# Altium project SDC_V2.1.PrjPcb (part 2 of 4)

## Sheet CTRL_IF.SchDoc
size 420 x 297 mm; SheetNumber: 7; PageSetup: Record=PageOptions|CenterHorizontal=False|CenterVertical=False|PrintScale=0.95|XCorrection=0.00|YCorrection=0.00|PrintKind=1|BorderSize=5000000|LeftOffset=0|BottomOffset=0|Orientation=1|PaperLength=1000|PaperWidth=1000|Scale=100|PaperSource=15|PrintQuality=600|MediaType=1|DitherType=10|PaperKind=A4|PrintScaleMode=1
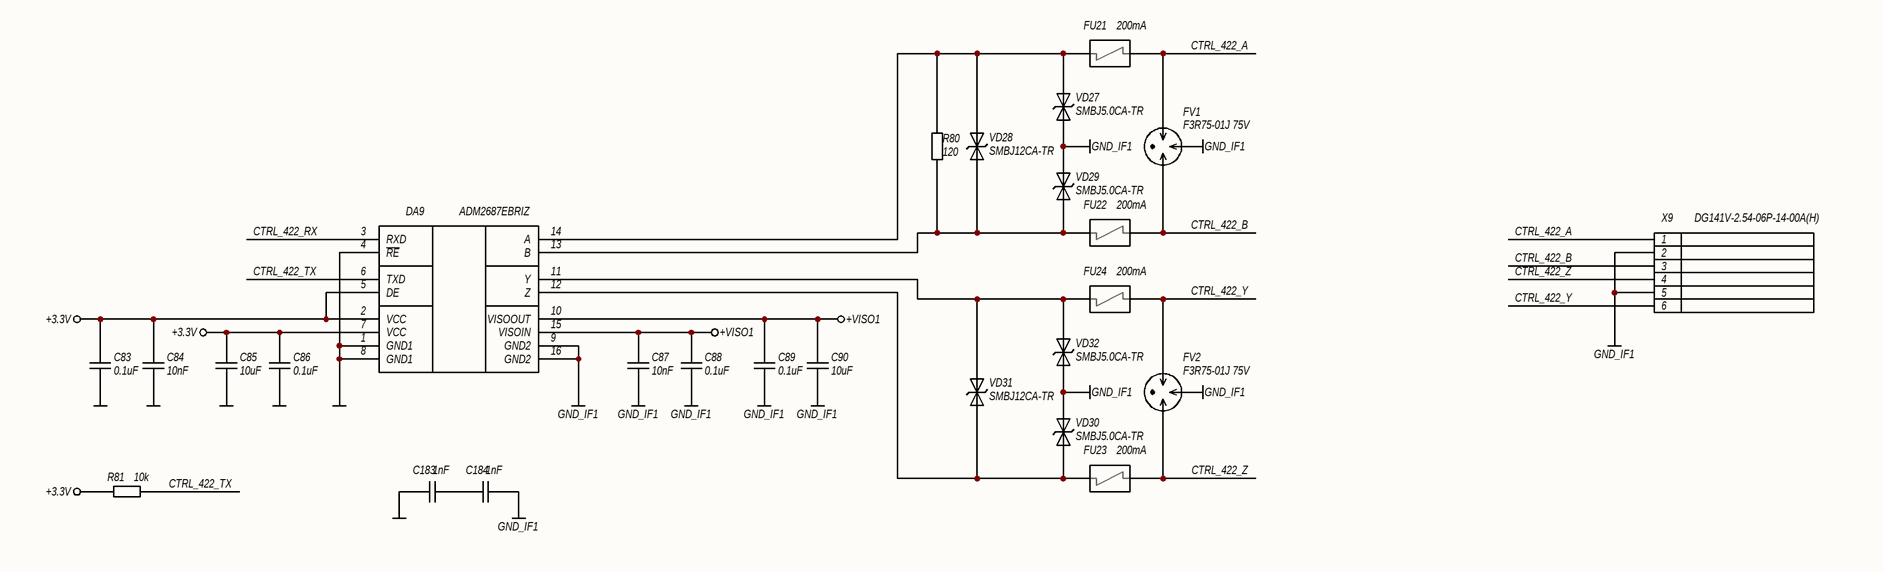
[diagram p5: CTRL_IF.SchDoc]

### Parts
C83  0.1uF  [C0603N]
C84  10nF  [C0603N]
C85  10uF  [C0805N]
C86  0.1uF  [C0603N]
C87  10nF  [C0603N]
C88  0.1uF  [C0603N]
C89  0.1uF  [C0603N]
C90  10uF  [C0805N]
C183  1nF  [C1808N]
C184  1nF  [C1808N]
DA9  ADM2687EBRIZ  [SOIC16_IC]
FU21  200mA  [TBU-CA]
FU22  200mA  [TBU-CA]
FU23  200mA  [TBU-CA]
FU24  200mA  [TBU-CA]
FV1  F3R75-01J 75V  [GDT_3PIN_B2]
FV2  F3R75-01J 75V  [GDT_3PIN_B2]
R80  120  [R0805N]
R81  10k  [R0603N]
VD27  SMBJ5.0CA-TR  [SMB]
VD28  SMBJ12CA-TR  [SMB]
VD29  SMBJ5.0CA-TR  [SMB]
VD30  SMBJ5.0CA-TR  [SMB]
VD31  SMBJ12CA-TR  [SMB]
VD32  SMBJ5.0CA-TR  [SMB]
X9  DG141V-2.54-06P-14-00A(H)  [DG141V-2.54-06P-14-00A(H)]

### Nets
+3.3V: C83.2 C84.1 C85.2 C86.2 DA9.2(VCC) DA9.5(DE) DA9.7(VCC) R81.2
+VISO1: C87.1 C88.2 C89.2 C90.2 DA9.10(VISOOUT) DA9.15(VISOIN)
GND: C83.1 C84.2 C85.1 C86.1 C183.2 DA9.1(GND1) DA9.4(~{RE}) DA9.8(GND1)
GND_IF1: C87.2 C88.1 C89.1 C90.1 C184.1 DA9.9(GND2) DA9.16(GND2) FV1.2 FV2.2 VD27.2(A2) VD29.2(A2) VD30.2(A2) VD32.2(A2) X9.2 X9.5
CTRL_422_A: FU21.3(IN/OUT) FV1.1 X9.1
CTRL_422_B: FU22.3(IN/OUT) FV1.3 X9.3
CTRL_422_RX: DA9.3(RXD)
CTRL_422_TX: DA9.6(TXD) R81.1
CTRL_422_Y: FU24.3(IN/OUT) FV2.3 X9.6
CTRL_422_Z: FU23.3(IN/OUT) FV2.1 X9.4
NetC183_1: C183.1 C184.2
NetDA9_11: DA9.11(Y) FU24.1(IN/OUT) VD31.2(A2) VD32.1(A1)
NetDA9_12: DA9.12(Z) FU23.1(IN/OUT) VD30.1(A1) VD31.1(A1)
NetDA9_13: DA9.13(B) FU22.1(IN/OUT) R80.2 VD28.2(A2) VD29.1(A1)
NetDA9_14: DA9.14(A) FU21.1(IN/OUT) R80.1 VD27.1(A1) VD28.1(A1)

### Notes on the sheet
- Подп. и дата
- Инв. № дубл.
- Взам. инв. №
- Инв. № подл.
- Лист
- Изм.
- № докум.
- Подп.
- Дата
- Копировал
- Формат А3

### Library data of the parts
C83 C86 C88 C89 = CL10B104KB8NNNC: as C3 on sheet MCU; Артикул: CL10B104KB8NNNC; Номинал: 0.1uF; Строка для документации: https://mm.digikey.com/Volume0/opasdata/d220001/medias/docus/609/CL10B104KB8NNNC_Spec.pdf; Тип элемента: Конденсатор
C84 C87 = CL10B103KB8NNNC: as C29 on sheet DRIVER_A; Артикул: CL10B103KB8NNNC; Номинал: 10nF; Строка для документации: https://mm.digikey.com/Volume0/opasdata/d220001/medias/docus/609/CL10B103KB8NNNC_Spec.pdf; Тип элемента: Конденсатор
C85 C90 = CL21A106KAYNNNE: Конденсатор; Точность: 10%; Напряжение: 25V; Диэлектрик: X5R; Производитель: Samsung Electro-Mechanics; Описание: 10 µF ±10% 25V Ceramic Capacitor X5R 0805 (2012 Metric); Корпус: 0805 (2012 Metric); Температурный диапазон: -55°C ~ 85°C; Вид монтажа: SMD; Артикул: CL21A106KAYNNNE; Номинал: 10uF; Строка для документации: https://mm.digikey.com/Volume0/opasdata/d220001/medias/docus/5545/CL21A106KAYNNNE%20Spec.pdf; Тип элемента: Конденсатор
C183 C184 = GA342DR7GF102KW02L: Конденсатор; Точность: 10%; Напряжение: 250VAC; Диэлектрик: X7R; Производитель: Murata Electronics; Описание: 1000 pF ±10% 250VAC Ceramic Capacitor X7R 1808 (4520 Metric); Корпус: 1808 (4520 Metric); Температурный диапазон: -55°C ~ 125°C; Вид монтажа: SMD; Артикул: GA342DR7GF102KW02L; Номинал: 1nF; Строка для документации: https://search.murata.co.jp/Ceramy/image/img/A01X/G101/ENG/GA342DR7GF102KW02-01.pdf; Тип элемента: Конденсатор
DA9 = ADM2687EBRIZ: Микросхема интерфейса RS485; Производитель: Analog Devices Inc.; Описание: RS422, RS485 Digital Isolator 5000Vrms 3 Channel 500kbps 25kV/µs CMTI 16-SOIC (0.295", 7.50mm Width); Корпус: 16-SOIC (0.295", 7.50mm Width); Температурный диапазон: -40°C ~ 85°C; Вид монтажа: SMD; Артикул: ADM2687EBRIZ; Строка для документации: https://www.analog.com/media/en/technical-documentation/data-sheets/ADM2682E_2687E.pdf; Тип элемента: Микросхема
FU21-FU24 = TBU-CA065-200-WH: Полупроводниковый предохранитель; Напряжение: 650V; Тип: Surge Suppression IС; Производитель: Bourns Inc.; Описание: SURGE SUPP TBU 200MA 650VIMP SMD; Корпус: 6.50mm x 4.00mm; Температурный диапазон: -55°C ~ 125°C; Вид монтажа: SMD; Артикул: TBU-CA065-200-WH; Ток: 200mA; Строка для документации: https://www.bourns.com/docs/Product-Datasheets/TBU-CA.pdf; Тип элемента: Предохранитель
FV1 FV2 = F3R75-01J 75V: Газовый разрядник, трехвыводный; Ток: 10kA; Тип: Gas Discharge Tube Arresters (GDT); Производитель: ZF; Описание: Gas Discharge Tube 75 V 10000A (10kA) ±25% 3 Pole Through Hole Mount; Корпус: 11.5mm x 7.5mm dia.; Вид монтажа: Through hole; Артикул: F3R75-01J 75V; Напряжение пробоя: 75V; Строка для документации: http://nbruitian.com/show.asp?id=1412; Тип элемента: Газовый разрядник
R80 = RC0805FR-07120RL: Резистор; Точность: 1%; ТКС: ±100ppm/°C; Напряжение: 150V; Производитель: YAGEO; Описание: 120 Ohms ±1% 0.125W, 1/8W Chip Resistor 0805 (2012 Metric) Moisture Resistant Thick Film; Корпус: 0805 (2012 Metric); Температурный диапазон: -55°C ~ 155°C; Вид монтажа: SMD; Артикул: RC0805FR-07120RL; Номинал: 120; Строка для документации: https://www.yageo.com/upload/media/product/productsearch/datasheet/rchip/PYu-RC_Group_51_RoHS_L_12.pdf; Тип элемента: Резистор
R81 = RC0603FR-0710KL: as R4 on sheet MCU; Артикул: RC0603FR-0710KL; Номинал: 10k; Строка для документации: https://www.yageo.com/upload/media/product/app/datasheet/rchip/pyu-rc_group_51_rohs_l.pdf; Тип элемента: Резистор
VD27 VD29 VD30 VD32 = SMBJ5.0CA-TR: TVS диод двунаправленный; Напряжение: 5V; Напряжение ограничения: 9.2V; Напряжение пробоя: 6.4V; Ток: 68A; Тип: TVS Bidirectional; Производитель: STMicroelectronics; Описание: 9.2V Clamp 68A Ipp Tvs Diode Surface Mount SMB (DO-214AA); Корпус: DO-214AA, SMB; Температурный диапазон: -55°C ~ 150°C (TJ); Вид монтажа: SMD; Тип элемента: Диод защитный; Артикул: SMBJ5.0CA-TR; Строка для документации: https://www.st.com/content/ccc/resource/technical/document/datasheet/19/78/91/39/07/cd/40/65/CD00001366.pdf/files/CD00001366.pdf/_jcr_content/translations/en.CD00001366.pdf
VD28 VD31 = SMBJ12CA-TR: TVS диод двунаправленный; Напряжение: 12V; Напряжение ограничения: 19.9V; Напряжение пробоя: 13.3V; Ток: 31A; Тип: TVS Bidirectional; Производитель: STMicroelectronics; Описание: 19.9V Clamp 31A Ipp Tvs Diode Surface Mount SMB (DO-214AA); Корпус: DO-214AA, SMB; Температурный диапазон: -55°C ~ 150°C (TJ); Вид монтажа: SMD; Тип элемента: Диод защитный; Артикул: SMBJ12CA-TR; Строка для документации: https://www.st.com/content/ccc/resource/technical/document/datasheet/19/78/91/39/07/cd/40/65/CD00001366.pdf/files/CD00001366.pdf/_jcr_content/translations/en.CD00001366.pdf
X9 = DG141V-2.54-06P-14-00A(H): as X7 on sheet INC_ENC_IF; Артикул: DG141V-2.54-06P-14-00A(H); Строка для документации: https://static.chipdip.ru/lib/874/DOC000874680.pdf; Тип элемента: Разъем

## Sheet TELEM_IF.SchDoc
size 420 x 297 mm; SheetNumber: 6; PageSetup: Record=PageOptions|CenterHorizontal=False|CenterVertical=False|PrintScale=0.95|XCorrection=0.00|YCorrection=0.00|PrintKind=1|BorderSize=5000000|LeftOffset=0|BottomOffset=0|Orientation=1|PaperLength=1000|PaperWidth=1000|Scale=100|PaperSource=15|PrintQuality=600|MediaType=1|DitherType=10|PaperKind=A4|PrintScaleMode=1
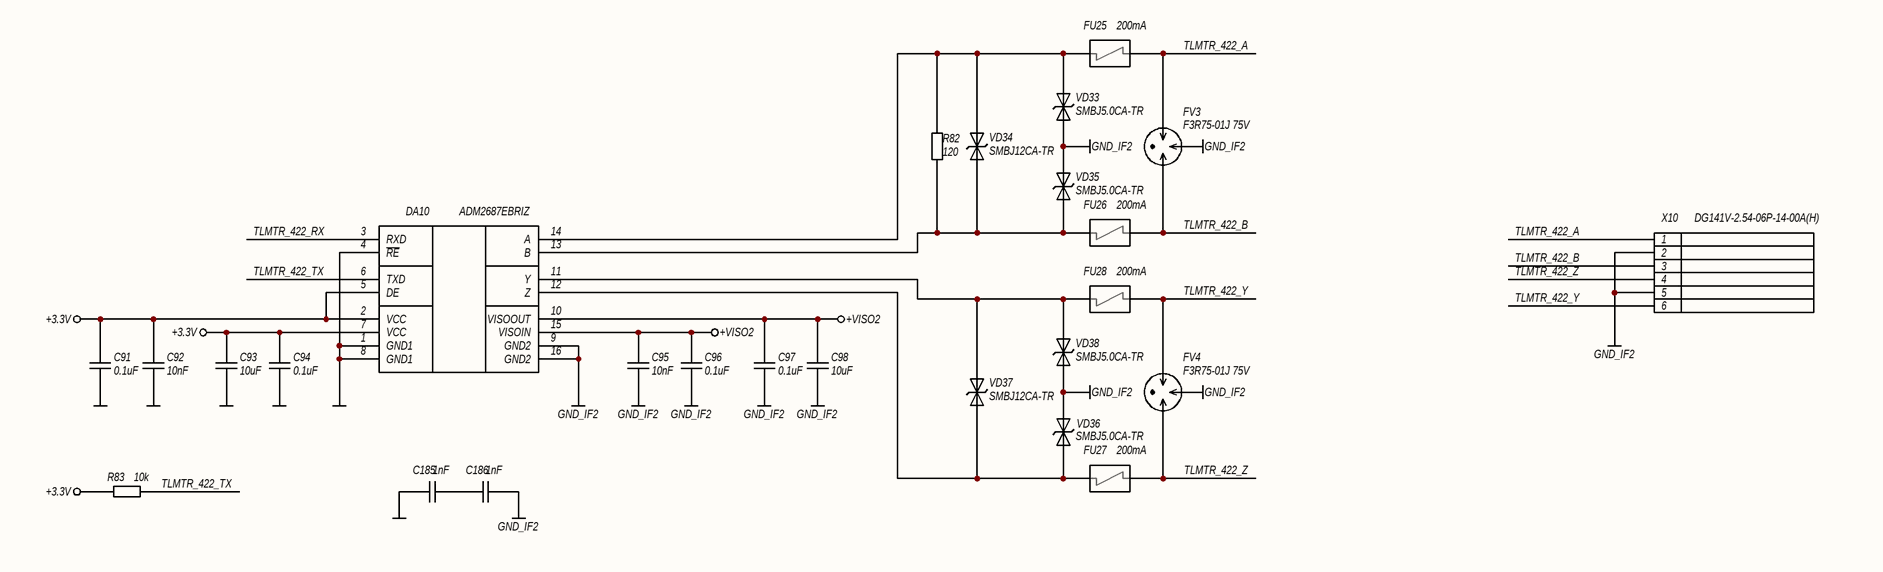
[diagram p6: TELEM_IF.SchDoc]

### Parts
C91  0.1uF  [C0603N]
C92  10nF  [C0603N]
C93  10uF  [C0805N]
C94  0.1uF  [C0603N]
C95  10nF  [C0603N]
C96  0.1uF  [C0603N]
C97  0.1uF  [C0603N]
C98  10uF  [C0805N]
C185  1nF  [C1808N]
C186  1nF  [C1808N]
DA10  ADM2687EBRIZ  [SOIC16_IC]
FU25  200mA  [TBU-CA]
FU26  200mA  [TBU-CA]
FU27  200mA  [TBU-CA]
FU28  200mA  [TBU-CA]
FV3  F3R75-01J 75V  [GDT_3PIN_B2]
FV4  F3R75-01J 75V  [GDT_3PIN_B2]
R82  120  [R0805N]
R83  10k  [R0603N]
VD33  SMBJ5.0CA-TR  [SMB]
VD34  SMBJ12CA-TR  [SMB]
VD35  SMBJ5.0CA-TR  [SMB]
VD36  SMBJ5.0CA-TR  [SMB]
VD37  SMBJ12CA-TR  [SMB]
VD38  SMBJ5.0CA-TR  [SMB]
X10  DG141V-2.54-06P-14-00A(H)  [DG141V-2.54-06P-14-00A(H)]

### Nets
+3.3V: C91.2 C92.1 C93.2 C94.2 DA10.2(VCC) DA10.5(DE) DA10.7(VCC) R83.2
+VISO2: C95.1 C96.2 C97.2 C98.2 DA10.10(VISOOUT) DA10.15(VISOIN)
GND: C91.1 C92.2 C93.1 C94.1 C185.2 DA10.1(GND1) DA10.4(~{RE}) DA10.8(GND1)
GND_IF2: C95.2 C96.1 C97.1 C98.1 C186.1 DA10.9(GND2) DA10.16(GND2) FV3.2 FV4.2 VD33.2(A2) VD35.2(A2) VD36.2(A2) VD38.2(A2) X10.2 X10.5
TLMTR_422_A: FU25.3(IN/OUT) FV3.1 X10.1
TLMTR_422_B: FU26.3(IN/OUT) FV3.3 X10.3
TLMTR_422_RX: DA10.3(RXD)
TLMTR_422_TX: DA10.6(TXD) R83.1
TLMTR_422_Y: FU28.3(IN/OUT) FV4.3 X10.6
TLMTR_422_Z: FU27.3(IN/OUT) FV4.1 X10.4
NetC185_1: C185.1 C186.2
NetDA10_11: DA10.11(Y) FU28.1(IN/OUT) VD37.2(A2) VD38.1(A1)
NetDA10_12: DA10.12(Z) FU27.1(IN/OUT) VD36.1(A1) VD37.1(A1)
NetDA10_13: DA10.13(B) FU26.1(IN/OUT) R82.2 VD34.2(A2) VD35.1(A1)
NetDA10_14: DA10.14(A) FU25.1(IN/OUT) R82.1 VD33.1(A1) VD34.1(A1)

### Notes on the sheet
- Подп. и дата
- Инв. № дубл.
- Взам. инв. №
- Инв. № подл.
- Лист
- Изм.
- № докум.
- Подп.
- Дата
- Копировал
- Формат А3

### Library data of the parts
C91 C94 C96 C97 = CL10B104KB8NNNC: as C3 on sheet MCU; Артикул: CL10B104KB8NNNC; Номинал: 0.1uF; Строка для документации: https://mm.digikey.com/Volume0/opasdata/d220001/medias/docus/609/CL10B104KB8NNNC_Spec.pdf; Тип элемента: Конденсатор
C92 C95 = CL10B103KB8NNNC: as C29 on sheet DRIVER_A; Артикул: CL10B103KB8NNNC; Номинал: 10nF; Строка для документации: https://mm.digikey.com/Volume0/opasdata/d220001/medias/docus/609/CL10B103KB8NNNC_Spec.pdf; Тип элемента: Конденсатор
C93 C98 = CL21A106KAYNNNE: as C85 on sheet CTRL_IF; Артикул: CL21A106KAYNNNE; Номинал: 10uF; Строка для документации: https://mm.digikey.com/Volume0/opasdata/d220001/medias/docus/5545/CL21A106KAYNNNE%20Spec.pdf; Тип элемента: Конденсатор
C185 C186 = GA342DR7GF102KW02L: as C183 on sheet CTRL_IF; Артикул: GA342DR7GF102KW02L; Номинал: 1nF; Строка для документации: https://search.murata.co.jp/Ceramy/image/img/A01X/G101/ENG/GA342DR7GF102KW02-01.pdf; Тип элемента: Конденсатор
DA10 = ADM2687EBRIZ: as DA9 on sheet CTRL_IF; Артикул: ADM2687EBRIZ; Строка для документации: https://www.analog.com/media/en/technical-documentation/data-sheets/ADM2682E_2687E.pdf; Тип элемента: Микросхема
FU25-FU28 = TBU-CA065-200-WH: as FU21 on sheet CTRL_IF; Артикул: TBU-CA065-200-WH; Ток: 200mA; Строка для документации: https://www.bourns.com/docs/Product-Datasheets/TBU-CA.pdf; Тип элемента: Предохранитель
FV3 FV4 = F3R75-01J 75V: as FV1 on sheet CTRL_IF; Артикул: F3R75-01J 75V; Напряжение пробоя: 75V; Строка для документации: http://nbruitian.com/show.asp?id=1412; Тип элемента: Газовый разрядник
R82 = RC0805FR-07120RL: as R80 on sheet CTRL_IF; Артикул: RC0805FR-07120RL; Номинал: 120; Строка для документации: https://www.yageo.com/upload/media/product/productsearch/datasheet/rchip/PYu-RC_Group_51_RoHS_L_12.pdf; Тип элемента: Резистор
R83 = RC0603FR-0710KL: as R4 on sheet MCU; Артикул: RC0603FR-0710KL; Номинал: 10k; Строка для документации: https://www.yageo.com/upload/media/product/app/datasheet/rchip/pyu-rc_group_51_rohs_l.pdf; Тип элемента: Резистор
VD33 VD35 VD36 VD38 = SMBJ5.0CA-TR: as VD27 on sheet CTRL_IF; Артикул: SMBJ5.0CA-TR; Строка для документации: https://www.st.com/content/ccc/resource/technical/document/datasheet/19/78/91/39/07/cd/40/65/CD00001366.pdf/files/CD00001366.pdf/_jcr_content/translations/en.CD00001366.pdf
VD34 VD37 = SMBJ12CA-TR: as VD28 on sheet CTRL_IF; Артикул: SMBJ12CA-TR; Строка для документации: https://www.st.com/content/ccc/resource/technical/document/datasheet/19/78/91/39/07/cd/40/65/CD00001366.pdf/files/CD00001366.pdf/_jcr_content/translations/en.CD00001366.pdf
X10 = DG141V-2.54-06P-14-00A(H): as X7 on sheet INC_ENC_IF; Артикул: DG141V-2.54-06P-14-00A(H); Строка для документации: https://static.chipdip.ru/lib/874/DOC000874680.pdf; Тип элемента: Разъем

## Sheet RS485_IF.SchDoc: {Наименование}
size 420 x 297 mm; ApprovedBy: {Утвердил}; CheckedBy: {Проверил}; DrawnBy: {Разраб.}; DocumentNumber: АБВГ 123456.789 00; SheetNumber: 7; SheetTotal: {}; Scale: {Мш.}; PageSetup: Record=PageOptions|CenterHorizontal=False|CenterVertical=False|PrintScale=0.95|XCorrection=0.00|YCorrection=0.00|PrintKind=1|BorderSize=5000000|LeftOffset=0|BottomOffset=0|Orientation=1|PaperLength=1000|PaperWidth=1000|Scale=100|PaperSource=15|PrintQuality=600|MediaType=1|DitherType=10|PaperKind=A4|PrintScaleMode=1; ProcessInspection: {Т.контр.}; Mass: {М.}; NormInspection: {Н.контр.}; Letter1Column: {}; Letter2Column: {}; Letter3Column: {}; DocumentType: {Документ}; Rule: PcbType=ProtelPcb
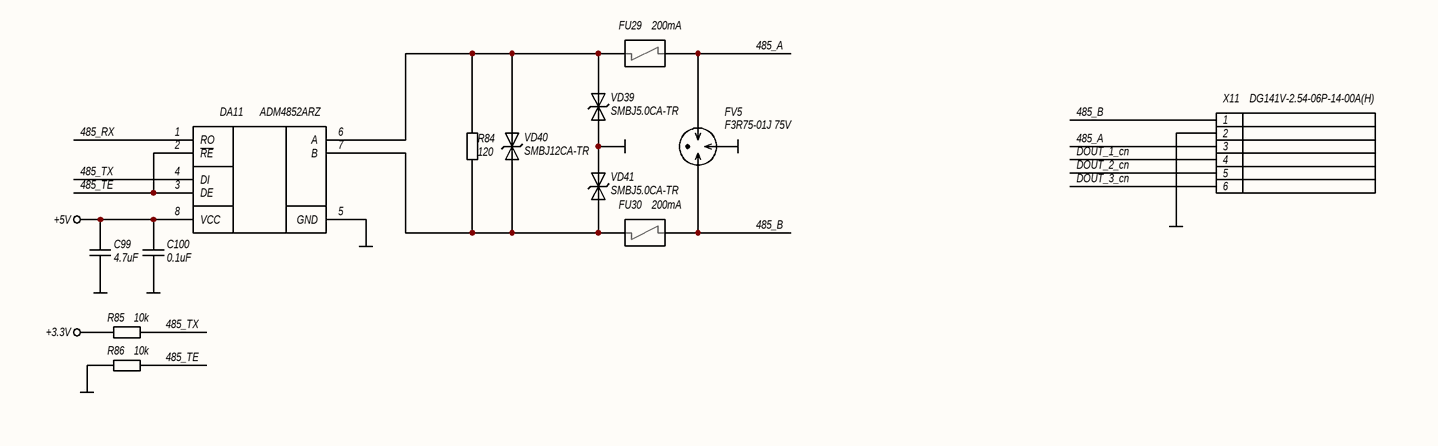
[diagram p7: RS485_IF.SchDoc]

### Parts
C99  4.7uF  [C0603N]
C100  0.1uF  [C0603N]
DA11  ADM4852ARZ  [SOIC8]
FU29  200mA  [TBU-CA]
FU30  200mA  [TBU-CA]
FV5  F3R75-01J 75V  [GDT_3PIN_B2]
R84  120  [R0805N]
R85  10k  [R0603N]
R86  10k  [R0603N]
VD39  SMBJ5.0CA-TR  [SMB]
VD40  SMBJ12CA-TR  [SMB]
VD41  SMBJ5.0CA-TR  [SMB]
X11  DG141V-2.54-06P-14-00A(H)  [DG141V-2.54-06P-14-00A(H)]

### Nets
+3.3V: R85.2
+5V: C99.2 C100.2 DA11.8(VCC)
GND: C99.1 C100.1 DA11.5(GND) FV5.2 R86.2 VD39.2(A2) VD41.2(A2) X11.2
485_A: FU29.3(IN/OUT) FV5.3 X11.3
485_B: FU30.3(IN/OUT) FV5.1 X11.1
485_RX: DA11.1(RO)
485_TE: DA11.2(~{RE}) DA11.3(DE) R86.1
485_TX: DA11.4(DI) R85.1
DOUT_1_cn: X11.4
DOUT_2_cn: X11.5
DOUT_3_cn: X11.6
NetDA11_6: DA11.6(A) FU29.1(IN/OUT) R84.2 VD39.1(A1) VD40.2(A2)
NetDA11_7: DA11.7(B) FU30.1(IN/OUT) R84.1 VD40.1(A1) VD41.1(A1)

### Notes on the sheet
- Подп. и дата
- Инв. № дубл.
- Взам. инв. №
- Инв. № подл.
- Лист
- Изм.
- № докум.
- Подп.
- Дата
- Копировал
- Формат А3

### Library data of the parts
C99 = CL10A475KO8NNNC: as C11 on sheet MCU; Артикул: CL10A475KO8NNNC; Номинал: 4.7uF; Строка для документации: https://mm.digikey.com/Volume0/opasdata/d220001/medias/docus/2328/CL10A475KO8NNNC_Spec.pdf; Тип элемента: Конденсатор
C100 = CL10B104KB8NNNC: as C3 on sheet MCU; Артикул: CL10B104KB8NNNC; Номинал: 0.1uF; Строка для документации: https://mm.digikey.com/Volume0/opasdata/d220001/medias/docus/609/CL10B104KB8NNNC_Spec.pdf; Тип элемента: Конденсатор
DA11 = ADM4852ARZ: Микросхема интерфейса RS485; Производитель: "D:\Altium\Libraries\GOST_LIBS\Libraries\IC\Analog Devices\ADM4852A.SchLib"; Описание: 1/1 Transceiver Half RS422, RS485 8-SOIC; Корпус: 8-SOIC (0.154", 3.90mm Width); Температурный диапазон: -40°C ~ 85°C; Вид монтажа: SMD; Артикул: ADM4852ARZ; Строка для документации: https://www.analog.com/media/en/technical-documentation/data-sheets/ADM4850_4851_4852_4853_4854_4855_4856_4857.pdf; Тип элемента: Микросхема
FU29 FU30 = TBU-CA065-200-WH: as FU21 on sheet CTRL_IF; Артикул: TBU-CA065-200-WH; Ток: 200mA; Строка для документации: https://www.bourns.com/docs/Product-Datasheets/TBU-CA.pdf; Тип элемента: Предохранитель
FV5 = F3R75-01J 75V: as FV1 on sheet CTRL_IF; Артикул: F3R75-01J 75V; Напряжение пробоя: 75V; Строка для документации: http://nbruitian.com/show.asp?id=1412; Тип элемента: Газовый разрядник
R84 = RC0805FR-07120RL: as R80 on sheet CTRL_IF; Артикул: RC0805FR-07120RL; Номинал: 120; Строка для документации: https://www.yageo.com/upload/media/product/productsearch/datasheet/rchip/PYu-RC_Group_51_RoHS_L_12.pdf; Тип элемента: Резистор
R85 R86 = RC0603FR-0710KL: as R4 on sheet MCU; Артикул: RC0603FR-0710KL; Номинал: 10k; Строка для документации: https://www.yageo.com/upload/media/product/app/datasheet/rchip/pyu-rc_group_51_rohs_l.pdf; Тип элемента: Резистор
VD39 VD41 = SMBJ5.0CA-TR: as VD27 on sheet CTRL_IF; Артикул: SMBJ5.0CA-TR; Строка для документации: https://www.st.com/content/ccc/resource/technical/document/datasheet/19/78/91/39/07/cd/40/65/CD00001366.pdf/files/CD00001366.pdf/_jcr_content/translations/en.CD00001366.pdf
VD40 = SMBJ12CA-TR: as VD28 on sheet CTRL_IF; Артикул: SMBJ12CA-TR; Строка для документации: https://www.st.com/content/ccc/resource/technical/document/datasheet/19/78/91/39/07/cd/40/65/CD00001366.pdf/files/CD00001366.pdf/_jcr_content/translations/en.CD00001366.pdf
X11 = DG141V-2.54-06P-14-00A(H): as X7 on sheet INC_ENC_IF; Артикул: DG141V-2.54-06P-14-00A(H); Строка для документации: https://static.chipdip.ru/lib/874/DOC000874680.pdf; Тип элемента: Разъем

## Sheet DISCRETE_IF.SchDoc: {Наименование}
size 420 x 297 mm; ApprovedBy: {Утвердил}; CheckedBy: {Проверил}; DrawnBy: {Разраб.}; DocumentNumber: АБВГ 123456.789 00; SheetNumber: 8; SheetTotal: {}; Scale: {Мш.}; PageSetup: Record=PageOptions|CenterHorizontal=False|CenterVertical=False|PrintScale=0.95|XCorrection=0.00|YCorrection=0.00|PrintKind=1|BorderSize=5000000|LeftOffset=0|BottomOffset=0|Orientation=1|PaperLength=1000|PaperWidth=1000|Scale=100|PaperSource=15|PrintQuality=600|MediaType=1|DitherType=10|PaperKind=A4|PrintScaleMode=1; ProcessInspection: {Т.контр.}; Mass: {М.}; NormInspection: {Н.контр.}; Letter1Column: {}; Letter2Column: {}; Letter3Column: {}; DocumentType: {Документ}; Rule: PcbType=ProtelPcb
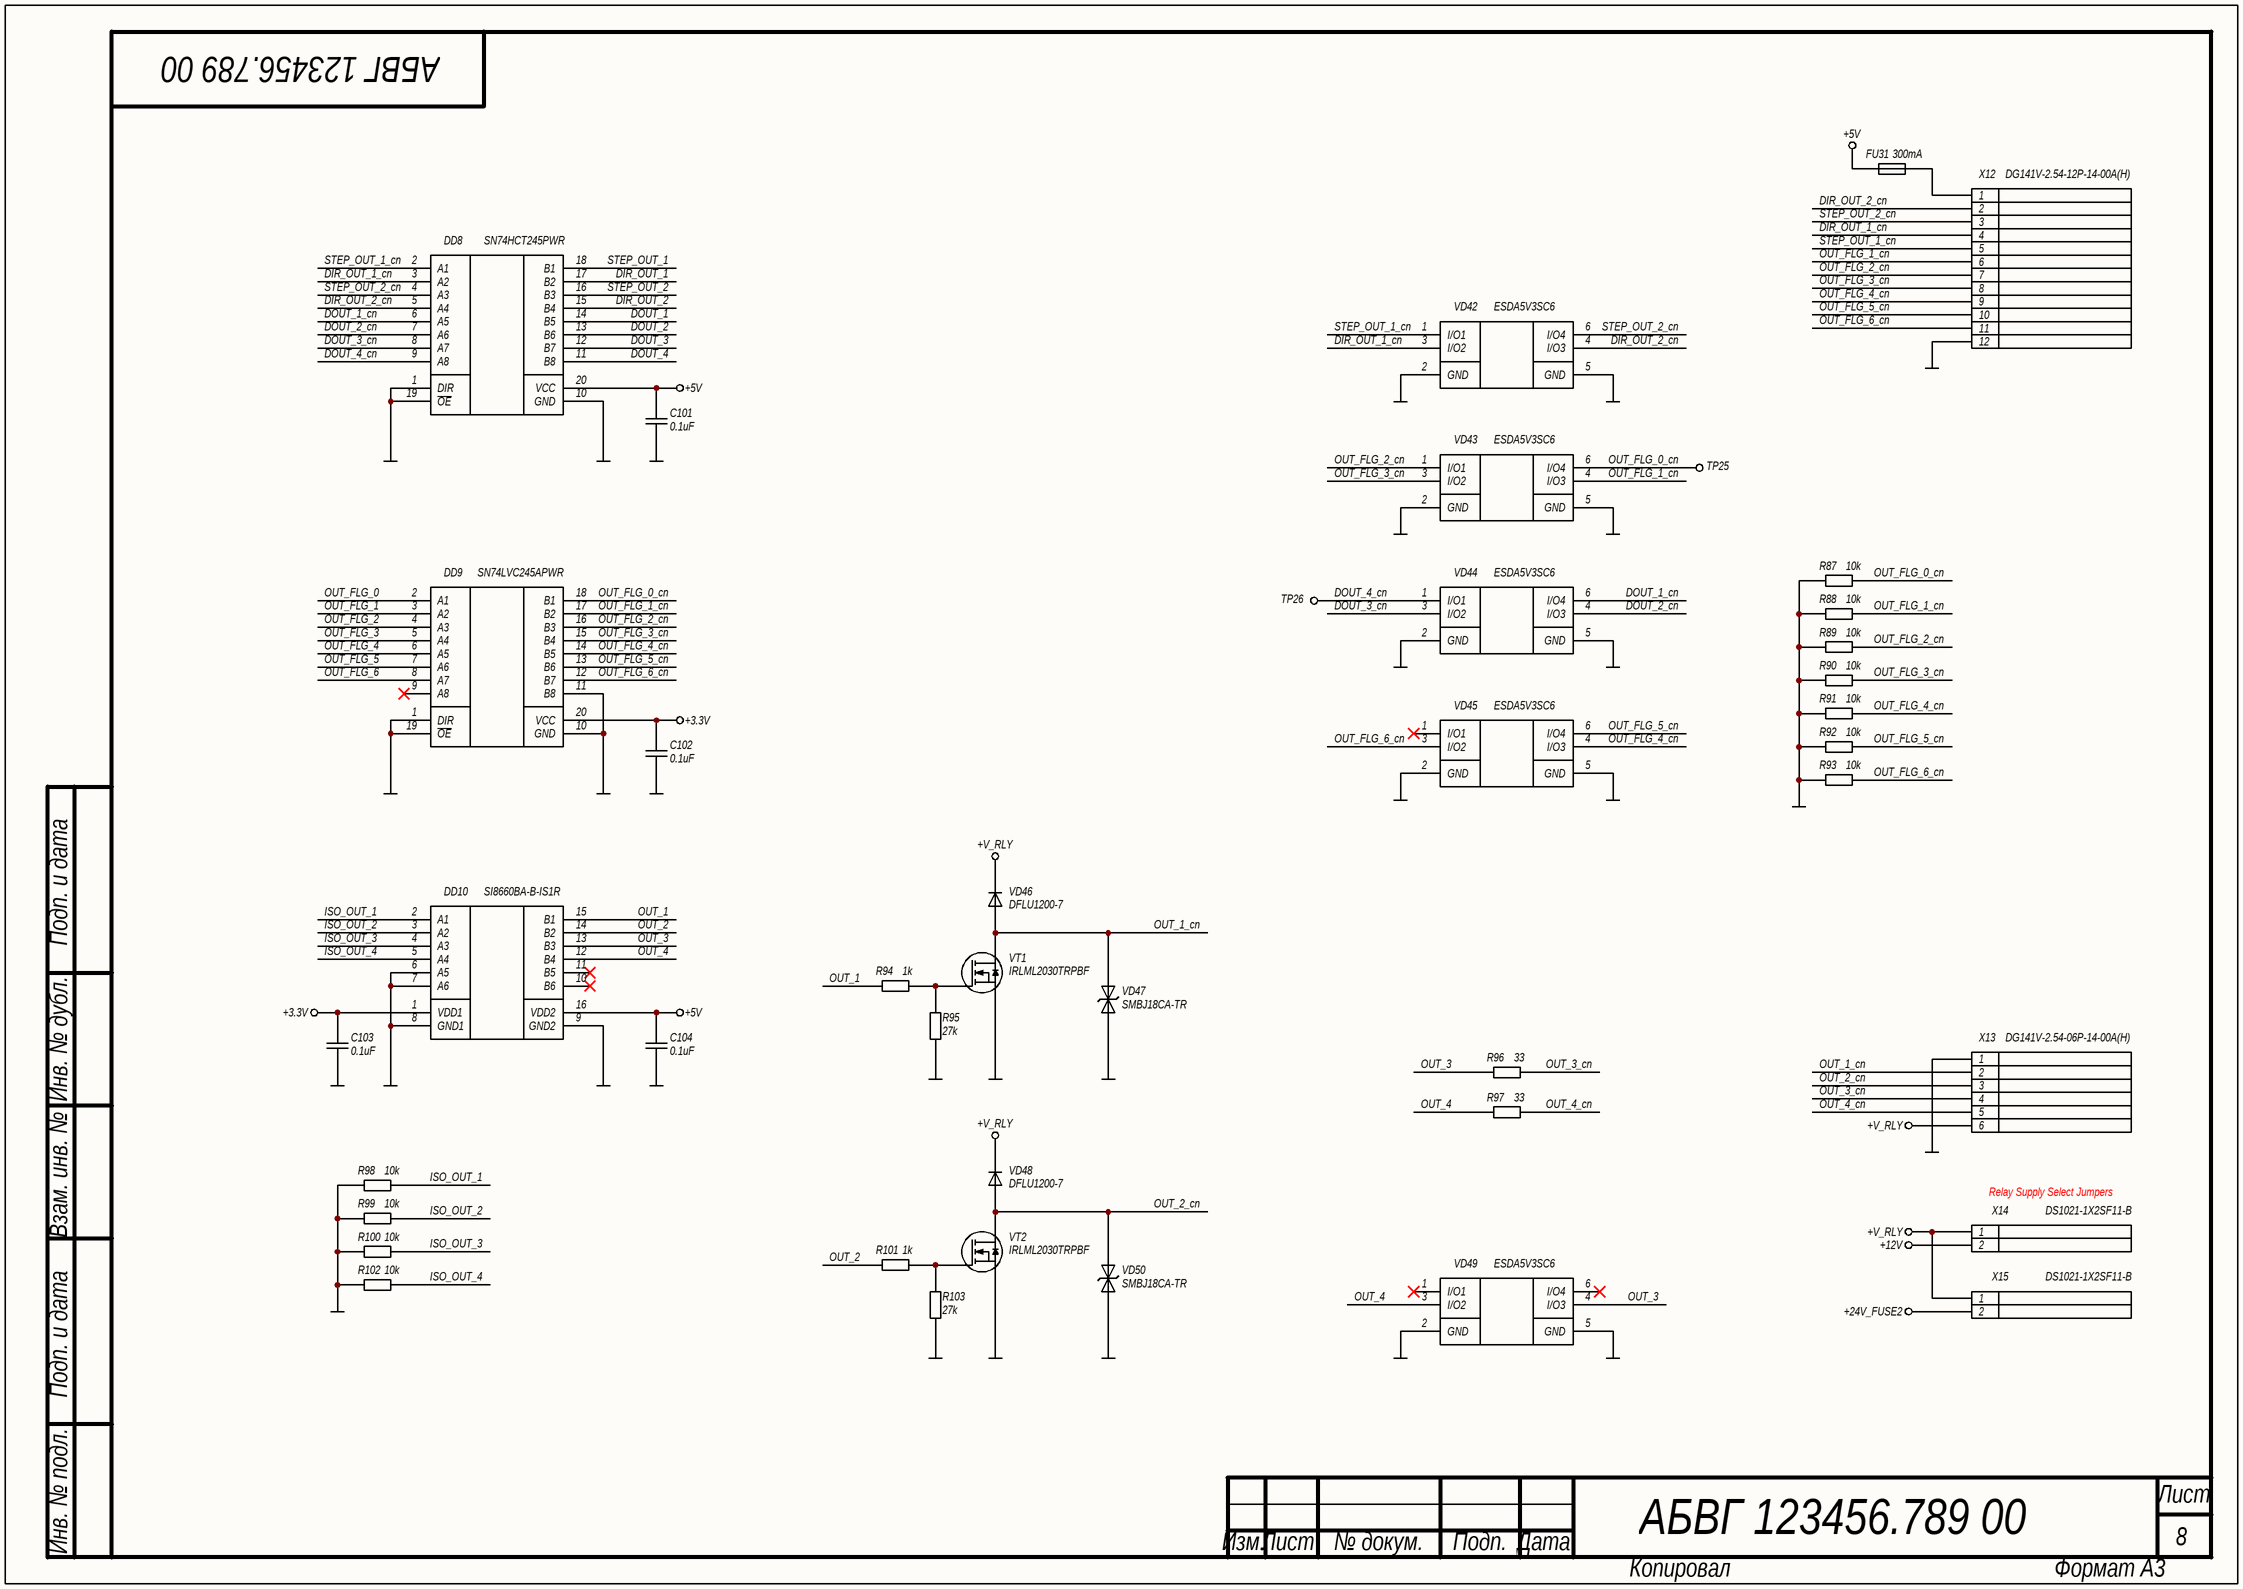
[diagram p8: DISCRETE_IF.SchDoc]

### Parts
C101  0.1uF  [C0603N]
C102  0.1uF  [C0603N]
C103  0.1uF  [C0603N]
C104  0.1uF  [C0603N]
DD8  SN74HCT245PWR  [TSSOP20]
DD9  SN74LVC245APWR  [TSSOP20]
DD10  SI8660BA-B-IS1R  [SOIC16]
FU31  300mA  [MF-MSMF]
R87  10k  [R0603N]
R88  10k  [R0603N]
R89  10k  [R0603N]
R90  10k  [R0603N]
R91  10k  [R0603N]
R92  10k  [R0603N]
R93  10k  [R0603N]
R94  1k  [R0603N]
R95  27k  [R0603N]
R96  33  [R0603N]
R97  33  [R0603N]
R98  10k  [R0603N]
R99  10k  [R0603N]
R100  10k  [R0603N]
R101  1k  [R0603N]
R102  10k  [R0603N]
R103  27k  [R0603N]
TP25  TEST_POINT  [TP_HOLE_1MM_1.5MM]  (value not drawn)  (no BOM)
TP26  TEST_POINT  [TP_HOLE_1MM_1.5MM]  (value not drawn)  (no BOM)
VD42  ESDA5V3SC6  [SOT23-6]
VD43  ESDA5V3SC6  [SOT23-6]
VD44  ESDA5V3SC6  [SOT23-6]
VD45  ESDA5V3SC6  [SOT23-6]
VD46  DFLU1200-7  [PowerDI123]
VD47  SMBJ18CA-TR  [SMB]
VD48  DFLU1200-7  [PowerDI123]
VD49  ESDA5V3SC6  [SOT23-6]
VD50  SMBJ18CA-TR  [SMB]
VT1  IRLML2030TRPBF  [SOT23]
VT2  IRLML2030TRPBF  [SOT23]
X12  DG141V-2.54-12P-14-00A(H)  [DG141V-2.54-12P-14-00A(H)]
X13  DG141V-2.54-06P-14-00A(H)  [DG141V-2.54-06P-14-00A(H)]
X14  DS1021-1X2SF11-B  [2.54_2X1_HEADER]
X15  DS1021-1X2SF11-B  [2.54_2X1_HEADER]

### Nets
+3.3V: C102.2 C103.2 DD9.20(VCC) DD10.1(VDD1)
+5V: C101.2 C104.2 DD8.20(VCC) DD10.16(VDD2) FU31.1
+12V: X14.2
+24V_FUSE2: X15.2
+V_RLY: VD46.1(K) VD48.1(K) X13.6 X14.1 X15.1
GND: C101.1 C102.1 C103.1 C104.1 DD8.1(DIR) DD8.10(GND) DD8.19(~{OE}) DD9.1(DIR) DD9.10(GND) DD9.11(B8) DD9.19(~{OE}) DD10.6(A5) DD10.7(A6) DD10.8(GND1) DD10.9(GND2) R87.2 R88.2 R89.2 R90.2 R91.2 R92.2 R93.2 R95.1 R98.2 R99.2 R100.2 R102.2 R103.1 VD42.2(GND) VD42.5(GND) VD43.2(GND) VD43.5(GND) VD44.2(GND) VD44.5(GND) VD45.2(GND) VD45.5(GND) VD47.2(A2) VD49.2(GND) VD49.5(GND) VD50.2(A2) VT1.2(S) VT2.2(S) X12.12 X13.1
DIR_OUT_1: DD8.17(B2)
DIR_OUT_1_cn: DD8.3(A2) VD42.3(I/O2) X12.4
DIR_OUT_2: DD8.15(B4)
DIR_OUT_2_cn: DD8.5(A4) VD42.4(I/O3) X12.2
DOUT_1: DD8.14(B5)
DOUT_1_cn: DD8.6(A5) VD44.6(I/O4)
DOUT_2: DD8.13(B6)
DOUT_2_cn: DD8.7(A6) VD44.4(I/O3)
DOUT_3: DD8.12(B7)
DOUT_3_cn: DD8.8(A7) VD44.3(I/O2)
DOUT_4: DD8.11(B8)
DOUT_4_cn: DD8.9(A8) TP26.1 VD44.1(I/O1)
ISO_OUT_1: DD10.2(A1) R98.1
ISO_OUT_2: DD10.3(A2) R99.1
ISO_OUT_3: DD10.4(A3) R100.1
ISO_OUT_4: DD10.5(A4) R102.1
OUT_1: DD10.15(B1) R94.2
OUT_1_cn: VD46.2(A) VD47.1(A1) VT1.3(D) X13.2
OUT_2: DD10.14(B2) R101.2
OUT_2_cn: VD48.2(A) VD50.1(A1) VT2.3(D) X13.3
OUT_3: DD10.13(B3) R96.2 VD49.4(I/O3)
OUT_3_cn: R96.1 X13.4
OUT_4: DD10.12(B4) R97.2 VD49.3(I/O2)
OUT_4_cn: R97.1 X13.5
OUT_FLG_0: DD9.2(A1)
OUT_FLG_0_cn: DD9.18(B1) R87.1 TP25.1 VD43.6(I/O4)
OUT_FLG_1: DD9.3(A2)
OUT_FLG_1_cn: DD9.17(B2) R88.1 VD43.4(I/O3) X12.6
OUT_FLG_2: DD9.4(A3)
OUT_FLG_2_cn: DD9.16(B3) R89.1 VD43.1(I/O1) X12.7
OUT_FLG_3: DD9.5(A4)
OUT_FLG_3_cn: DD9.15(B4) R90.1 VD43.3(I/O2) X12.8
OUT_FLG_4: DD9.6(A5)
OUT_FLG_4_cn: DD9.14(B5) R91.1 VD45.4(I/O3) X12.9
OUT_FLG_5: DD9.7(A6)
OUT_FLG_5_cn: DD9.13(B6) R92.1 VD45.6(I/O4) X12.10
OUT_FLG_6: DD9.8(A7)
OUT_FLG_6_cn: DD9.12(B7) R93.1 VD45.3(I/O2) X12.11
STEP_OUT_1: DD8.18(B1)
STEP_OUT_1_cn: DD8.2(A1) VD42.1(I/O1) X12.5
STEP_OUT_2: DD8.16(B3)
STEP_OUT_2_cn: DD8.4(A3) VD42.6(I/O4) X12.3
NetFU31_2: FU31.2 X12.1
NetR94_1: R94.1 R95.2 VT1.1(G)
NetR101_1: R101.1 R103.2 VT2.1(G)

Not connected (* = marked no-connect by the designer): DD9 9(A8)*; DD10 10(B6)* 11(B5)*; VD45 1(I/O1)*; VD49 1(I/O1)* 6(I/O4)*

### Notes on the sheet
- (near X14) Relay Supply Select Jumpers
- Подп. и дата
- Инв. № дубл.
- Взам. инв. №
- Инв. № подл.
- Лист
- Изм.
- № докум.
- Подп.
- Дата
- Копировал
- Формат А3

### Library data of the parts
C101-C104 = CL10B104KB8NNNC: Конденсатор; Точность: 10%; Напряжение: 50V; Диэлектрик: X7R; Производитель: Samsung Electro-Mechanics; Описание: 0.1 µF ±10% 50V Ceramic Capacitor X7R 0603 (1608 Metric); Корпус: 0603 (1608 Metric); Температурный диапазон: -55°C ~ 125°C; Вид монтажа: SMD; Артикул: CL10B104KB8NNNC; Номинал: 0.1uF; Строка для документации: https://mm.digikey.com/Volume0/opasdata/d220001/medias/docus/609/CL10B104KB8NNNC_Spec.pdf; Тип элемента: Конденсатор
DD8 = SN74HCT245PWR: Микросхема шинный формирователь; Производитель: Texas Instruments; Описание: Transceiver, Non-Inverting 1 Element 8 Bit per Element 3-State Output 20-TSSOP; Корпус: 20-TSSOP (0.173", 4.40mm Width); Температурный диапазон: -40°C ~ 85°C (TA); Вид монтажа: SMD; Артикул: SN74HCT245PWR; Строка для документации: https://www.ti.com/lit/ds/symlink/sn74hct245.pdf; Тип элемента: Микросхема
DD9 = SN74LVC245APWR: Микросхема шинный формирователь; Производитель: Texas Instruments; Описание: Transceiver, Non-Inverting 1 Element 8 Bit per Element 3-State Output 20-TSSOP; Корпус: 20-TSSOP (0.173", 4.40mm Width); Температурный диапазон: -40°C ~ 125°C (TA); Вид монтажа: SMD; Артикул: SN74LVC245APWR; Строка для документации: https://www.ti.com/lit/ds/scas218x/scas218x.pdf; Тип элемента: Микросхема
DD10 = SI8660BA-B-IS1R: Микросхема цифровой изолятор; Производитель: Skyworks Solutions Inc.; Описание: General Purpose Digital Isolator 1000Vrms 6 Channel 150Mbps 35kV/µs CMTI 16-SOIC (0.154", 3.90mm Width); Корпус: 16-SOIC (0.154", 3.90mm Width); Температурный диапазон: -40°C ~ 125°C; Вид монтажа: SMD; Артикул: SI8660BA-B-IS1R; Строка для документации: https://www.skyworksinc.com/-/media/Skyworks/SL/documents/public/data-sheets/Si866x.pdf; Тип элемента: Микросхема
FU31 = MF-MSMF030-2: Плавкий предохранитель; Напряжение: 30V; Тип: PTC Resettable Fuse; Производитель: Bourns Inc.; Описание: Polymeric PTC Resettable Fuse 30V 300 mA Ih Surface Mount 1812 (4532 Metric), Concave; Корпус: 1812 (4532 Metric), Concave; Температурный диапазон: -40°C ~ 85°C; Вид монтажа: SMD; Артикул: MF-MSMF030-2; Ток: 300mA; Строка для документации: https://www.bourns.com/docs/product-datasheets/mf-msmf.pdf; Тип элемента: Предохранитель
R87-R93 R98-R100 R102 = RC0603FR-0710KL: Резистор; Точность: 1%; ТКС: ±100ppm/°C; Напряжение: 75V; Производитель: YAGEO; Описание: 10 kOhms ±1% 0.1W, 1/10W Chip Resistor 0603 (1608 Metric) Moisture Resistant Thick Film; Корпус: 0603 (1608 Metric); Температурный диапазон: -55°C ~ 155°C; Вид монтажа: SMD; Артикул: RC0603FR-0710KL; Номинал: 10k; Строка для документации: https://www.yageo.com/upload/media/product/app/datasheet/rchip/pyu-rc_group_51_rohs_l.pdf; Тип элемента: Резистор
R94 R101 = RC0603JR-071KL: Резистор; Точность: 5%; ТКС: ±100ppm/°C; Напряжение: 75V; Производитель: YAGEO; Описание: 1 kOhms ±5% 0.1W, 1/10W Chip Resistor 0603 (1608 Metric) Moisture Resistant Thick Film; Корпус: 0603 (1608 Metric); Температурный диапазон: -55°C ~ 155°C; Вид монтажа: SMD; Артикул: RC0603JR-071KL; Номинал: 1k; Строка для документации: https://www.yageo.com/upload/media/product/app/datasheet/rchip/pyu-rc_group_51_rohs_l.pdf; Тип элемента: Резистор
R95 R103 = RC0603FR-0727KL: Резистор; Точность: 1%; ТКС: ±100ppm/°C; Напряжение: 75V; Производитель: YAGEO; Описание: 27 kOhms Jumper Chip Resistor 0603 (1608 Metric) Moisture Resistant Thick Film; Корпус: 0603 (1608 Metric); Температурный диапазон: -55°C ~ 155°C; Вид монтажа: SMD; Артикул: RC0603FR-0727KL; Номинал: 27k; Строка для документации: https://www.yageo.com/upload/media/product/app/datasheet/rchip/pyu-rc_group_51_rohs_l.pdf; Тип элемента: Резистор
R96 R97 = RC0603FR-0733RL: Резистор; Точность: 1%; ТКС: ±100ppm/°C; Напряжение: 75V; Производитель: YAGEO; Описание: 33 Ohms ±1% 0.1W, 1/10W Chip Resistor 0603 (1608 Metric) Moisture Resistant Thick Film; Корпус: 0603 (1608 Metric); Температурный диапазон: -55°C ~ 155°C; Вид монтажа: SMD; Артикул: RC0603FR-0733RL; Номинал: 33; Строка для документации: https://www.yageo.com/upload/media/product/app/datasheet/rchip/pyu-rc_group_51_rohs_l.pdf; Тип элемента: Резистор
TP25 TP26 = Test Point, Round Pad/Hole 1.5mm/1.0mm diameter: Контрольная точка; Количество контактов: 1; Описание: Test Point, Round Pad/Hole, 1.5mm/1.0mm diameter; Тип элемента: Разъем; Артикул: Test Point, Round Pad/Hole 1.5mm/1.0mm diameter; Тип разъема: Test Point
VD42-VD45 VD49 = ESDA5V3SC6: Сборка TVS диодов, 4-канальная; Напряжение: 3V; Напряжение ограничения: 21V; Напряжение пробоя: 5.3V; Ток: 22A; Тип: TVS Unidirectional; Производитель: STMicroelectronics; Описание: Clamp Ipp Tvs Diode Surface Mount SOT-23-6; Корпус: SOT-23-6; Температурный диапазон: -40°C ~ 150°C (TJ); Вид монтажа: SMD; Тип элемента: Диод защитный; Артикул: ESDA5V3SC6; Строка для документации: https://www.st.com/content/ccc/resource/technical/document/datasheet/7f/2e/1d/82/74/9c/4b/a1/CD00002055.pdf/files/CD00002055.pdf/jcr:content/translations/en.CD00002055.pdf
VD46 VD48 = DFLU1200-7: Диод; Прямой ток: 1A; Напряжение: 200V; Тип: Standard; Производитель: Diodes Incorporated; Описание: Diode 200 V 1A Surface Mount PowerDI™ 123; Корпус: PowerDI™ 123; Температурный диапазон: -65°C ~ 150°C; Вид монтажа: SMD; Артикул: DFLU1200-7; Строка для документации: https://www.diodes.com/assets/Datasheets/ds30601.pdf; Тип элемента: Диод
VD47 VD50 = SMBJ18CA-TR: TVS диод двунаправленный; Напряжение: 18V; Напряжение ограничения: 29.2V; Напряжение пробоя: 20V; Ток: 21.5A; Тип: TVS Bidirectional; Производитель: STMicroelectronics; Описание: 29.2V Clamp 21.5A Ipp Tvs Diode Surface Mount SMB (DO-214AA); Корпус: DO-214AA, SMB; Температурный диапазон: -55°C ~ 150°C (TJ); Вид монтажа: SMD; Тип элемента: Диод защитный; Артикул: SMBJ18CA-TR; Строка для документации: https://www.st.com/content/ccc/resource/technical/document/datasheet/19/78/91/39/07/cd/40/65/CD00001366.pdf/files/CD00001366.pdf/_jcr_content/translations/en.CD00001366.pdf
VT1 VT2 = IRLML2030TRPBF: МОП транзистор, N-канальный; Ток: 2.7A; Напряжение: 30V; Сопротивление канала: 100m; Пороговое напряжение: 2.3V; Тип: N-MOSFET; Производитель: Infineon Technologies; Описание: N-Channel 30 V 2.7A (Ta) 1.3W (Ta) Surface Mount Micro3™/SOT-23; Корпус: SOT-23-3; Температурный диапазон: -55°C ~ 150°C (TJ); Вид монтажа: SMD; Тип элемента: Транзистор полевой; Артикул: IRLML2030TRPBF; Строка для документации: https://www.infineon.com/dgdl/irlml2030pbf.pdf?fileId=5546d462533600a401535664aef525ec
X12 = DG141V-2.54-12P-14-00A(H): Разъем, 12 контактов; Тип разъема: Push-Button terminal block; Количество контактов: 12; Шаг контактов: 2.54mm; Ток: 2A; Напряжение: 150V; Производитель: Degson Electronics; Описание: 12 Position Wire to Board Terminal Block Vertical with Board 0.100" (2.54mm) Through Hole; Температурный диапазон: -40°C ~ 105°C; Вид монтажа: Through Hole; Артикул: DG141V-2.54-12P-14-00A(H); Строка для документации: https://static.chipdip.ru/lib/874/DOC000874680.pdf; Тип элемента: Разъем
X13 = DG141V-2.54-06P-14-00A(H): Разъем, 6 контактов; Тип разъема: Push-Button terminal block; Количество контактов: 6; Шаг контактов: 2.54mm; Ток: 2A; Напряжение: 150V; Производитель: Degson Electronics; Описание: 6 Position Wire to Board Terminal Block Vertical with Board 0.100" (2.54mm) Through Hole; Температурный диапазон: -40°C ~ 105°C; Вид монтажа: Through Hole; Артикул: DG141V-2.54-06P-14-00A(H); Строка для документации: https://static.chipdip.ru/lib/874/DOC000874680.pdf; Тип элемента: Разъем
X14 X15 = DS1021-1X2SF11-B: Разъем, 2 контакта; Тип разъема: Header, Male Pin; Количество контактов: 2; Шаг контактов: 2.54mm; Ток: 3A; Напряжение: 250V; Производитель: Connfly electronic (Zhenqin); Описание: Connector Header Through Hole 2 position 0.100" (2.54mm); Температурный диапазон: -40°C ~ 105°C; Вид монтажа: Through Hole; Артикул: DS1021-1X2SF11-B; Строка для документации: http://cn.connfly.group/static/upload/file/pdf/DS1021.pdf; Тип элемента: Разъем

## Sheet SNS_INPUT.SchDoc: {Наименование}
size 420 x 297 mm; ApprovedBy: {Утвердил}; CheckedBy: {Проверил}; DrawnBy: {Разраб.}; DocumentNumber: АБВГ 123456.789 00; SheetNumber: 9; SheetTotal: {}; Scale: {Мш.}; PageSetup: Record=PageOptions|CenterHorizontal=False|CenterVertical=False|PrintScale=0.95|XCorrection=0.00|YCorrection=0.00|PrintKind=1|BorderSize=5000000|LeftOffset=0|BottomOffset=0|Orientation=1|PaperLength=1000|PaperWidth=1000|Scale=100|PaperSource=15|PrintQuality=600|MediaType=1|DitherType=10|PaperKind=A4|PrintScaleMode=1; ProcessInspection: {Т.контр.}; Mass: {М.}; NormInspection: {Н.контр.}; Letter1Column: {}; Letter2Column: {}; Letter3Column: {}; DocumentType: {Документ}; Rule: PcbType=ProtelPcb
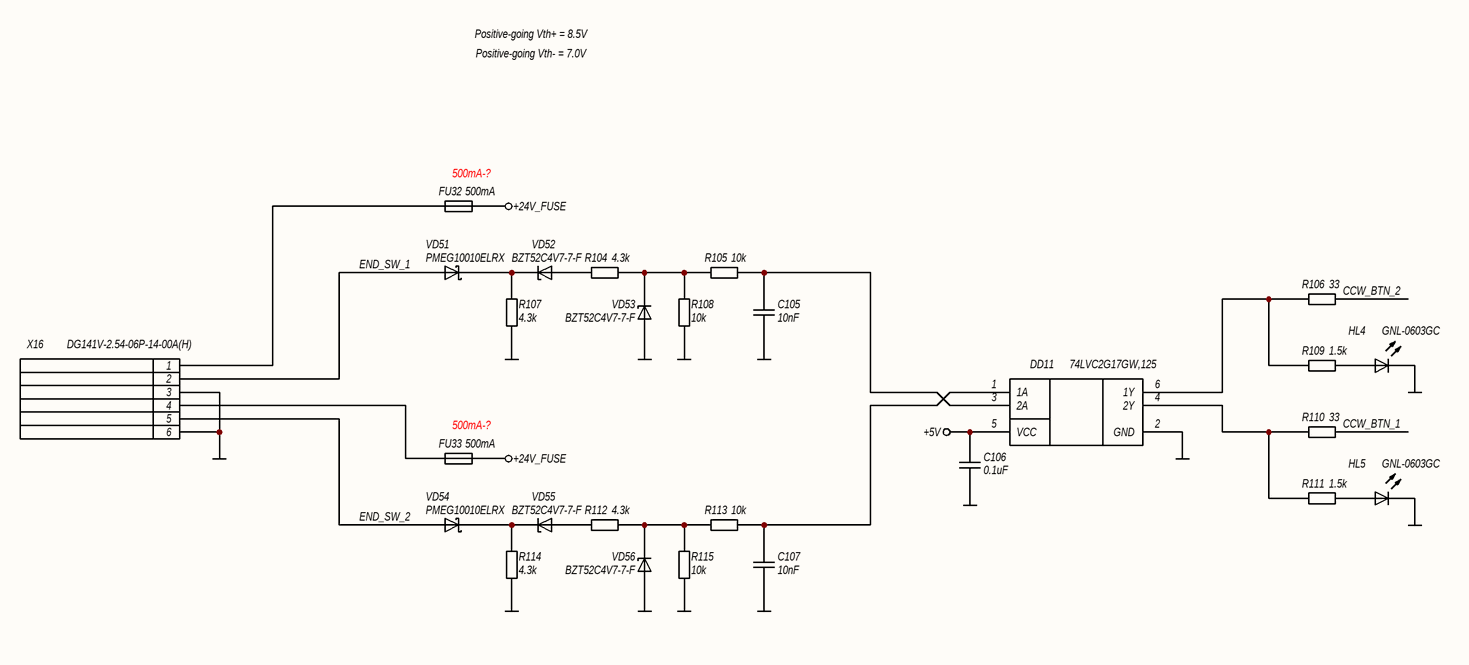
[diagram p9: SNS_INPUT.SchDoc]

### Parts
C105  10nF  [C0603N]
C106  0.1uF  [C0603N]
C107  10nF  [C0603N]
DD11  74LVC2G17GW,125  [SOT363-2]
FU32  500mA  [MF-MSMF]
FU33  500mA  [MF-MSMF]
HL4  GNL-0603GC  [LED0603]
HL5  GNL-0603GC  [LED0603]
R104  4.3k  [R1206N]
R105  10k  [R0603N]
R106  33  [R0603N]
R107  4.3k  [R1206N]
R108  10k  [R0603N]
R109  1.5k  [R0603N]
R110  33  [R0603N]
R111  1.5k  [R0603N]
R112  4.3k  [R1206N]
R113  10k  [R0603N]
R114  4.3k  [R1206N]
R115  10k  [R0603N]
VD51  PMEG10010ELRX  [SOD123W]
VD52  BZT52C4V7-7-F  [SOD123]
VD53  BZT52C4V7-7-F  [SOD123]
VD54  PMEG10010ELRX  [SOD123W]
VD55  BZT52C4V7-7-F  [SOD123]
VD56  BZT52C4V7-7-F  [SOD123]
X16  DG141V-2.54-06P-14-00A(H)  [DG141V-2.54-06P-14-00A(H)]

### Nets
+5V: C106.2 DD11.5(VCC)
+24V_FUSE: FU32.2 FU33.2
GND: C105.2 C106.1 C107.2 DD11.2(GND) HL4.1(K) HL5.1(K) R107.2 R108.2 R114.2 R115.2 VD53.2(A) VD56.2(A) X16.3 X16.6
CCW_BTN_1: R110.1
CCW_BTN_2: R106.1
END_SW_1: VD51.2(A) X16.2
END_SW_2: VD54.2(A) X16.5
NetC105_1: C105.1 DD11.3(2A) R105.1
NetC107_1: C107.1 DD11.1(1A) R113.1
NetDD11_4: DD11.4(2Y) R110.2 R111.2
NetDD11_6: DD11.6(1Y) R106.2 R109.2
NetFU32_1: FU32.1 X16.1
NetFU33_1: FU33.1 X16.4
NetHL4_2: HL4.2(A) R109.1
NetHL5_2: HL5.2(A) R111.1
NetR104_1: R104.1 R105.2 R108.1 VD53.1(K)
NetR104_2: R104.2 VD52.2(A)
NetR107_1: R107.1 VD51.1(K) VD52.1(K)
NetR112_1: R112.1 R113.2 R115.1 VD56.1(K)
NetR112_2: R112.2 VD55.2(A)
NetR114_1: R114.1 VD54.1(K) VD55.1(K)

### Notes on the sheet
- Positive-going Vth+ = 8.5V
- Positive-going Vth- = 7.0V
- (near FU32) 500mA-?
- (near FU33) 500mA-?
- Подп. и дата
- Инв. № дубл.
- Взам. инв. №
- Инв. № подл.
- Лист
- Изм.
- № докум.
- Подп.
- Дата
- Копировал
- Формат А3

### Library data of the parts
C105 C107 = CL10B103KB8NNNC: Конденсатор; Точность: 10%; Напряжение: 16V; Диэлектрик: X7R; Производитель: Samsung Electro-Mechanics; Описание: 10000 pF ±10% 50V Ceramic Capacitor X7R 0603 (1608 Metric); Корпус: 0603 (1608 Metric); Температурный диапазон: -55°C ~ 125°C; Вид монтажа: SMD; Артикул: CL10B103KB8NNNC; Номинал: 10nF; Строка для документации: https://mm.digikey.com/Volume0/opasdata/d220001/medias/docus/609/CL10B103KB8NNNC_Spec.pdf; Тип элемента: Конденсатор
C106 = CL10B104KB8NNNC: as C101-C104 on sheet DISCRETE_IF; Артикул: CL10B104KB8NNNC; Номинал: 0.1uF; Строка для документации: https://mm.digikey.com/Volume0/opasdata/d220001/medias/docus/609/CL10B104KB8NNNC_Spec.pdf; Тип элемента: Конденсатор
DD11 = 74LVC2G17GW,125: Микросхема сдвоенный триггер Шмитта; Производитель: Nexperia USA Inc.; Описание: Buffer, Non-Inverting 2 Element 1 Bit per Element Push-Pull Output 6-TSSOP; Корпус: 6-TSSOP; Температурный диапазон: -40°C ~ 125°C (TA); Вид монтажа: SMD; Артикул: 74LVC2G17GW,125; Строка для документации: https://assets.nexperia.com/documents/data-sheet/74LVC2G17.pdf; Тип элемента: Микросхема
FU32 FU33 = MF-MSMF050/40X-2: Плавкий предохранитель; Напряжение: 40V; Тип: PTC Resettable Fuse; Производитель: Bourns Inc.; Описание: Polymeric PTC Resettable Fuse 40V 500 mA Ih Surface Mount 1812 (4532 Metric), Concave; Корпус: 1812 (4532 Metric), Concave; Температурный диапазон: -40°C ~ 85°C; Вид монтажа: SMD; Артикул: MF-MSMF050/40X-2; Ток: 500mA; Строка для документации: https://www.bourns.com/docs/product-datasheets/mf-msmf.pdf; Тип элемента: Предохранитель
HL4 HL5 = GNL-0603GC: Светодиод; Прямой ток: 20mA; Напряжение: 2V; Яркость: 12mcd; Цвет: Зеленый; Длина волны: 567nm; Производитель: G-nor Electronics; Описание: Green 567nm LED Indication - Discrete 2V 0603 (1608 Metric); Корпус: 0603 (1608 Metric); Температурный диапазон: -40°C ~ 80°C; Вид монтажа: SMD; Тип элемента: Диод светоизлучающий; Артикул: GNL-0603GC; Строка для документации: https://www.g-nor.com/Uploads/Ed/file/20210517/1621223120713818.doc
R104 R107 R112 R114 = RC1206FR-074K3L: Резистор; Точность: 1%; ТКС: ±100ppm/°C; Напряжение: 75V; Производитель: YAGEO; Описание: 4.3 kOhms ±1% 0.1W, 1/10W Chip Resistor 0603 (1608 Metric) Moisture Resistant Thick Film; Корпус: 1206 (3216 Metric); Температурный диапазон: -55°C ~ 155°C; Вид монтажа: SMD; Артикул: RC1206FR-074K3L; Номинал: 4.3k; Строка для документации: https://www.yageo.com/upload/media/product/productsearch/datasheet/rchip/PYu-RC_Group_51_RoHS_L_12.pdf; Тип элемента: Резистор
R105 R108 R113 R115 = RC0603FR-0710KL: as R87-R93 on sheet DISCRETE_IF; Артикул: RC0603FR-0710KL; Номинал: 10k; Строка для документации: https://www.yageo.com/upload/media/product/app/datasheet/rchip/pyu-rc_group_51_rohs_l.pdf; Тип элемента: Резистор
R106 R110 = RC0603FR-0733RL: as R96 on sheet DISCRETE_IF; Артикул: RC0603FR-0733RL; Номинал: 33; Строка для документации: https://www.yageo.com/upload/media/product/app/datasheet/rchip/pyu-rc_group_51_rohs_l.pdf; Тип элемента: Резистор
R109 R111 = RC0603FR-071K5L: Резистор; Точность: 1%; ТКС: ±100ppm/°C; Напряжение: 75V; Производитель: YAGEO; Описание: 1.5 kOhms ±1% 0.1W, 1/10W Chip Resistor 0603 (1608 Metric) Moisture Resistant Thick Film; Корпус: 0603 (1608 Metric); Температурный диапазон: -55°C ~ 155°C; Вид монтажа: SMD; Артикул: RC0603FR-071K5L; Номинал: 1.5k; Строка для документации: https://www.yageo.com/upload/media/product/app/datasheet/rchip/pyu-rc_group_51_rohs_l.pdf; Тип элемента: Резистор
VD51 VD54 = PMEG10010ELRX: Диод Шоттки; Прямой ток: 1A; Напряжение: 100V; Производитель: Nexperia USA Inc.; Описание: Diode 100 V 1A Surface Mount SOD-123W; Корпус: SOD-123W; Температурный диапазон: -40°C ~ 175°C; Вид монтажа: SMD; Артикул: PMEG10010ELRX; Тип: Schottky; Строка для документации: https://assets.nexperia.com/documents/data-sheet/PMEG10010ELR.pdf; Тип элемента: Диод
VD52 VD53 VD55 VD56 = BZT52C4V7-7-F: Стабилитрон; Прямой ток: 5mA; Напряжение: 4.7V; Производитель: Diodes Incorporated; Описание: Zener Diode 4.7 V 500 mW ±6% Surface Mount SOD-123; Корпус: SOD-123; Температурный диапазон: -65°C ~ 150°C; Вид монтажа: SMD; Тип элемента: Диод; Артикул: BZT52C4V7-7-F; Тип: Zener; Строка для документации: https://www.diodes.com/assets/Datasheets/ds18010.pdf
X16 = DG141V-2.54-06P-14-00A(H): as X13 on sheet DISCRETE_IF; Артикул: DG141V-2.54-06P-14-00A(H); Строка для документации: https://static.chipdip.ru/lib/874/DOC000874680.pdf; Тип элемента: Разъем

## Sheet ETHERNET.SchDoc: {Наименование}
size 420 x 297 mm; ApprovedBy: {Утвердил}; CheckedBy: {Проверил}; DrawnBy: {Разраб.}; DocumentNumber: АБВГ 123456.789 00; SheetNumber: 10; SheetTotal: {}; Scale: {Мш.}; PageSetup: Record=PageOptions|CenterHorizontal=False|CenterVertical=False|PrintScale=0.95|XCorrection=0.00|YCorrection=0.00|PrintKind=1|BorderSize=5000000|LeftOffset=0|BottomOffset=0|Orientation=1|PaperLength=1000|PaperWidth=1000|Scale=100|PaperSource=15|PrintQuality=600|MediaType=1|DitherType=10|PaperKind=A4|PrintScaleMode=1; ProcessInspection: {Т.контр.}; Mass: {М.}; NormInspection: {Н.контр.}; Letter1Column: {}; Letter2Column: {}; Letter3Column: {}; DocumentType: {Документ}; Rule: PcbType=ProtelPcb
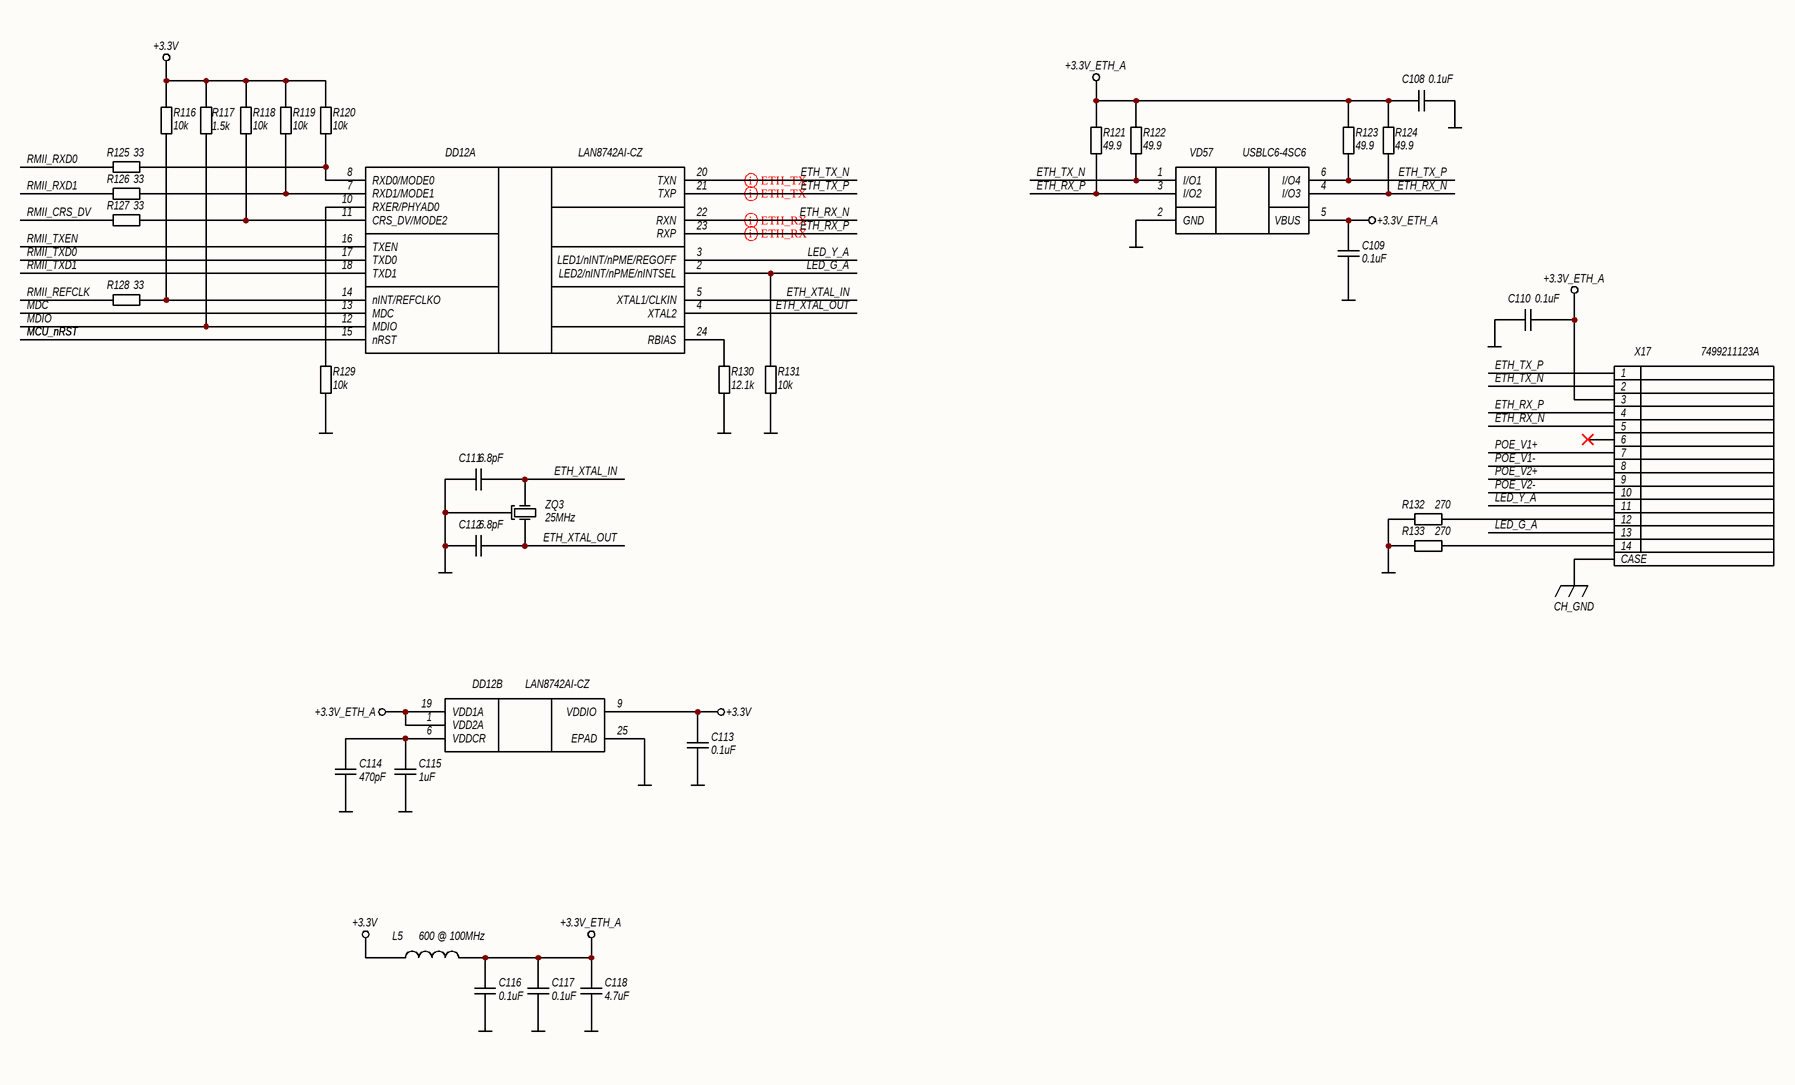
[diagram p10: ETHERNET.SchDoc]

### Parts
C108  0.1uF  [C0603N]
C109  0.1uF  [C0603N]
C110  0.1uF  [C0603N]
C111  6.8pF  [C0603N]
C112  6.8pF  [C0603N]
C113  0.1uF  [C0603N]
C114  470pF  [C0603N]
C115  1uF  [C0603N]
C116  0.1uF  [C0603N]
C117  0.1uF  [C0603N]
C118  4.7uF  [C0603N]
DD12  LAN8742AI-CZ  [S4QFN-24]  (parts A,B of 2)
L5  600 @ 100MHz  [FB0603N]
R116  10k  [R0603N]
R117  1.5k  [R0603N]
R118  10k  [R0603N]
R119  10k  [R0603N]
R120  10k  [R0603N]
R121  49.9  [R0603N]
R122  49.9  [R0603N]
R123  49.9  [R0603N]
R124  49.9  [R0603N]
R125  33  [R0603N]
R126  33  [R0603N]
R127  33  [R0603N]
R128  33  [R0603N]
R129  10k  [R0603N]
R130  12.1k  [R0603N]
R131  10k  [R0603N]
R132  270  [R0603N]
R133  270  [R0603N]
VD57  USBLC6-4SC6  [SOT23-6]
X17  7499211123A  [7499211123A]
ZQ3  25MHz  [NX3225GA]

### Nets
+3.3V: C113.2 DD12.9(VDDIO) L5.1 R116.1 R117.1 R118.1 R119.1 R120.1
+3.3V_ETH_A: C108.2 C109.2 C110.1 C116.2 C117.2 C118.2 DD12.1(VDD2A) DD12.19(VDD1A) L5.2 R121.2 R122.2 R123.2 R124.2 VD57.5(VBUS) X17.3
CH_GND: X17.15(CASE)
GND: C108.1 C109.1 C110.2 C111.2 C112.2 C113.1 C114.1 C115.1 C116.1 C117.1 C118.1 DD12.25(EPAD) R129.1 R130.1 R131.1 R132.1 R133.1 VD57.2(GND) ZQ3.2
ETH_RX_N: DD12.22(RXN) R124.1 VD57.4(I/O3) X17.5
ETH_RX_P: DD12.23(RXP) R121.1 VD57.3(I/O2) X17.4
ETH_TX_N: DD12.20(TXN) R122.1 VD57.1(I/O1) X17.2
ETH_TX_P: DD12.21(TXP) R123.1 VD57.6(I/O4) X17.1
ETH_XTAL_IN: C111.1 DD12.5(XTAL1/CLKIN) ZQ3.1
ETH_XTAL_OUT: C112.1 DD12.4(XTAL2) ZQ3.3
LED_G_A: DD12.2(LED2/nINT/nPME/nINTSEL) R131.2 X17.13
LED_Y_A: DD12.3(LED1/nINT/nPME/REGOFF) X17.11
MCU_nRST: DD12.15(nRST)
MDC: DD12.13(MDC)
MDIO: DD12.12(MDIO) R117.2
POE_V1+: X17.7
POE_V1-: X17.8
POE_V2+: X17.9
POE_V2-: X17.10
RMII_CRS_DV: R127.2
RMII_REFCLK: R128.2
RMII_RXD0: R125.2
RMII_RXD1: R126.2
RMII_TXD0: DD12.17(TXD0)
RMII_TXD1: DD12.18(TXD1)
RMII_TXEN: DD12.16(TXEN)
NetC114_2: C114.2 C115.2 DD12.6(VDDCR)
NetDD12_7: DD12.7(RXD1/MODE1) R119.2 R126.1
NetDD12_8: DD12.8(RXD0/MODE0) R120.2 R125.1
NetDD12_10: DD12.10(RXER/PHYAD0) R129.2
NetDD12_11: DD12.11(CRS_DV/MODE2) R118.2 R127.1
NetDD12_14: DD12.14(nINT/REFCLKO) R116.2 R128.1
NetDD12_24: DD12.24(RBIAS) R130.2
NetR132_2: R132.2 X17.12
NetR133_2: R133.2 X17.14

Not connected (* = marked no-connect by the designer): X17 6*

### Layout directives
differential pair; differential pair class ETH_TX: ETH_TX_N, ETH_TX_P
differential pair; differential pair class ETH_RX: ETH_RX_N, ETH_RX_P

### Notes on the sheet
- Подп. и дата
- Инв. № дубл.
- Взам. инв. №
- Инв. № подл.
- Лист
- Изм.
- № докум.
- Подп.
- Дата
- Копировал
- Формат А3

### Library data of the parts
C108-C110 C113 C116 C117 = CL10B104KB8NNNC: as C101-C104 on sheet DISCRETE_IF; Артикул: CL10B104KB8NNNC; Номинал: 0.1uF; Строка для документации: https://mm.digikey.com/Volume0/opasdata/d220001/medias/docus/609/CL10B104KB8NNNC_Spec.pdf; Тип элемента: Конденсатор
C111 C112 = CC0603CRNPO9BN6R8: Конденсатор; Точность: ±0.25pF; Напряжение: 50V; Диэлектрик: NP0; Производитель: YAGEO; Описание: 6.8 pF ±0.25pF 50V Ceramic Capacitor C0G, NP0 0603 (1608 Metric); Корпус: 0603 (1608 Metric); Температурный диапазон: -55°C ~ 125°C; Вид монтажа: SMD; Артикул: CC0603CRNPO9BN6R8; Номинал: 6.8pF; Строка для документации: https://www.yageo.com/upload/media/product/productsearch/datasheet/mlcc/UPY-GP_NP0_16V-to-50V_18.pdf; Тип элемента: Конденсатор
C114 = CL10C471JB8NNNC: Конденсатор; Точность: 5%; Напряжение: 50V; Диэлектрик: NP0; Производитель: Samsung Electro-Mechanics; Описание: 470 pF ±5% 50V Ceramic Capacitor C0G, NP0 0603 (1608 Metric); Корпус: 0603 (1608 Metric); Температурный диапазон: -55°C ~ 125°C; Вид монтажа: SMD; Артикул: CL10C471JB8NNNC; Номинал: 470pF; Строка для документации: https://www.samsungsem.com/resources/file/global/support/product_catalog/MLCC.pdf; Тип элемента: Конденсатор
C115 = CL10B105KO8NNNC: Конденсатор; Точность: 10%; Напряжение: 16V; Диэлектрик: X7R; Производитель: YAGEO; Описание: 1 µF ±10% 16V Ceramic Capacitor X7R 0603 (1608 Metric); Корпус: 0603 (1608 Metric); Температурный диапазон: -55°C ~ 125°C; Вид монтажа: SMD; Артикул: CL10B105KO8NNNC; Номинал: 1uF; Строка для документации: https://weblib.samsungsem.com/mlcc/mlcc-ec-data-sheet.do?partNumber=CL10B105KO8NNN; Тип элемента: Конденсатор
C118 = CL10A475KO8NNNC: Конденсатор; Точность: 10%; Напряжение: 16V; Диэлектрик: X5R; Производитель: Samsung Electro-Mechanics; Описание: 4.7 µF ±10% 16V Ceramic Capacitor X5R 0603 (1608 Metric); Корпус: 0603 (1608 Metric); Температурный диапазон: -55°C ~ 85°C; Вид монтажа: SMD; Артикул: CL10A475KO8NNNC; Номинал: 4.7uF; Строка для документации: https://mm.digikey.com/Volume0/opasdata/d220001/medias/docus/2328/CL10A475KO8NNNC_Spec.pdf; Тип элемента: Конденсатор
DD12 = LAN8742AI-CZ: Микросхема физического уровня Ethernet 10/100, RMII; Производитель: Microchip Technology; Описание: 1/1 Transceiver Full Ethernet 24-SQFN (4x4); Корпус: 24-VFQFN Exposed Pad; Температурный диапазон: -40°C ~ 85°C; Вид монтажа: SMD; Артикул: LAN8742AI-CZ; Строка для документации: https://ww1.microchip.com/downloads/en/DeviceDoc/DS_LAN8742_00001989A.pdf; Тип элемента: Микросхема
L5 = BLM18AG601SN1D: Фильтр ЭМП индуктивный; Ток: 500mA; Сопротивление: 380m; Тип: Ferrite Bead; Производитель: Murata Electronics; Описание: 600 Ohms @ 100 MHz 1 Ferrite Bead 0603 (1608 Metric) 500mA 380mOhm; Корпус: 0603 (1608 Metric); Температурный диапазон: -55°C ~ 125°C; Вид монтажа: SMD; Артикул: BLM18AG601SN1D; Номинал: 600 @ 100MHz; Строка для документации: https://www.murata.com/en-us/products/productdata/8796738650142/ENFA0003.pdf; Тип элемента: Фильтр ЭМП
R116 R118-R120 R129 R131 = RC0603FR-0710KL: as R87-R93 on sheet DISCRETE_IF; Артикул: RC0603FR-0710KL; Номинал: 10k; Строка для документации: https://www.yageo.com/upload/media/product/app/datasheet/rchip/pyu-rc_group_51_rohs_l.pdf; Тип элемента: Резистор
R117 = RC0603FR-071K5L: as R109 on sheet SNS_INPUT; Артикул: RC0603FR-071K5L; Номинал: 1.5k; Строка для документации: https://www.yageo.com/upload/media/product/app/datasheet/rchip/pyu-rc_group_51_rohs_l.pdf; Тип элемента: Резистор
R121-R124 = RC0603FR-0749R9L: Резистор; Точность: 1%; ТКС: ±100ppm/°C; Напряжение: 75V; Производитель: YAGEO; Описание: 49.9 Ohms ±1% 0.1W, 1/10W Chip Resistor 0603 (1608 Metric) Moisture Resistant Thick Film; Корпус: 0603 (1608 Metric); Температурный диапазон: -55°C ~ 155°C; Вид монтажа: SMD; Артикул: RC0603FR-0749R9L; Номинал: 49.9; Строка для документации: https://www.yageo.com/upload/media/product/app/datasheet/rchip/pyu-rc_group_51_rohs_l.pdf; Тип элемента: Резистор
R125-R128 = RC0603FR-0733RL: as R96 on sheet DISCRETE_IF; Артикул: RC0603FR-0733RL; Номинал: 33; Строка для документации: https://www.yageo.com/upload/media/product/app/datasheet/rchip/pyu-rc_group_51_rohs_l.pdf; Тип элемента: Резистор
R130 = RC0603FR-0712K1L: Резистор; Точность: 1%; ТКС: ±100ppm/°C; Напряжение: 75V; Производитель: YAGEO; Описание: 12.1 kOhms ±1% 0.1W, 1/10W Chip Resistor 0603 (1608 Metric) Moisture Resistant Thick Film; Корпус: 0603 (1608 Metric); Температурный диапазон: -55°C ~ 155°C; Вид монтажа: SMD; Артикул: RC0603FR-0712K1L; Номинал: 12.1k; Строка для документации: https://www.yageo.com/upload/media/product/app/datasheet/rchip/pyu-rc_group_51_rohs_l.pdf; Тип элемента: Резистор
R132 R133 = RC0603FR-07270RL: Резистор; Точность: 1%; ТКС: ±100ppm/°C; Напряжение: 75V; Производитель: YAGEO; Описание: 270 Ohms ±1% 0.1W, 1/10W Chip Resistor 0603 (1608 Metric) Moisture Resistant Thick Film; Корпус: 0603 (1608 Metric); Температурный диапазон: -55°C ~ 155°C; Вид монтажа: SMD; Артикул: RC0603FR-07270RL; Номинал: 270; Строка для документации: https://www.yageo.com/upload/media/product/app/datasheet/rchip/pyu-rc_group_51_rohs_l.pdf; Тип элемента: Резистор
VD57 = USBLC6-4SC6: Сборка TVS диодов, 4-канальная; Напряжение: 5.25V; Напряжение ограничения: 17V; Напряжение пробоя: 6V; Ток: 5A; Тип: TVS Unidirectional; Производитель: STMicroelectronics; Описание: 17V Clamp 5A (8/20µs) Ipp Tvs Diode Surface Mount SOT-23-6; Корпус: SOT-23-6; Температурный диапазон: -40°C ~ 125°C (TJ); Вид монтажа: SMD; Тип элемента: Диод защитны; Артикул: USBLC6-4SC6; Строка для документации: https://www.st.com/content/ccc/resource/technical/document/datasheet/9a/e6/1c/4f/b6/9a/44/e6/CD00047494.pdf/files/CD00047494.pdf/jcr:content/translations/en.CD00047494.pdf
X17 = 7499211123A: Разъем, 14 контактов+корпус; Тип разъема: Modular Connector with Magnetics; Количество контактов: 8; Шаг контактов: 0.635mm; Производитель: Würth Elektronik; Описание: 1 Port RJ45Through Hole 10/100 Base-T, AutoMDIX, Power over Ethernet (PoE); Температурный диапазон: 0°C ~ 70°C; Вид монтажа: SMD; Артикул: 7499211123A; Строка для документации: https://www.we-online.com/katalog/datasheet/7499211123A.pdf; Тип элемента: Разъем
ZQ3 = NX3225GA-25.000M: Кварцевый резонатор, экранированный; Точность: ±20ppm; Описание: 25 MHz ±20ppm Crystal 8pF 50 Ohms 4-SMD, No Lead; Тип: MHz Crystal; Производитель: NDK America, Inc.; Температурный диапазон: -40°C ~ 85°C; Корпус: 3.20mm x 2.50mm; Вид монтажа: SMD; Артикул: NX3225GA-25.000M; Частота: 25MHz; Строка для документации: https://www.ndk.com/en/products/upload/lineup/pdf/NDKX03-00006_en.pdf; Тип элемента: Кварцевый резонатор